# EAGLE design Front (EAGLE 9.2.2)
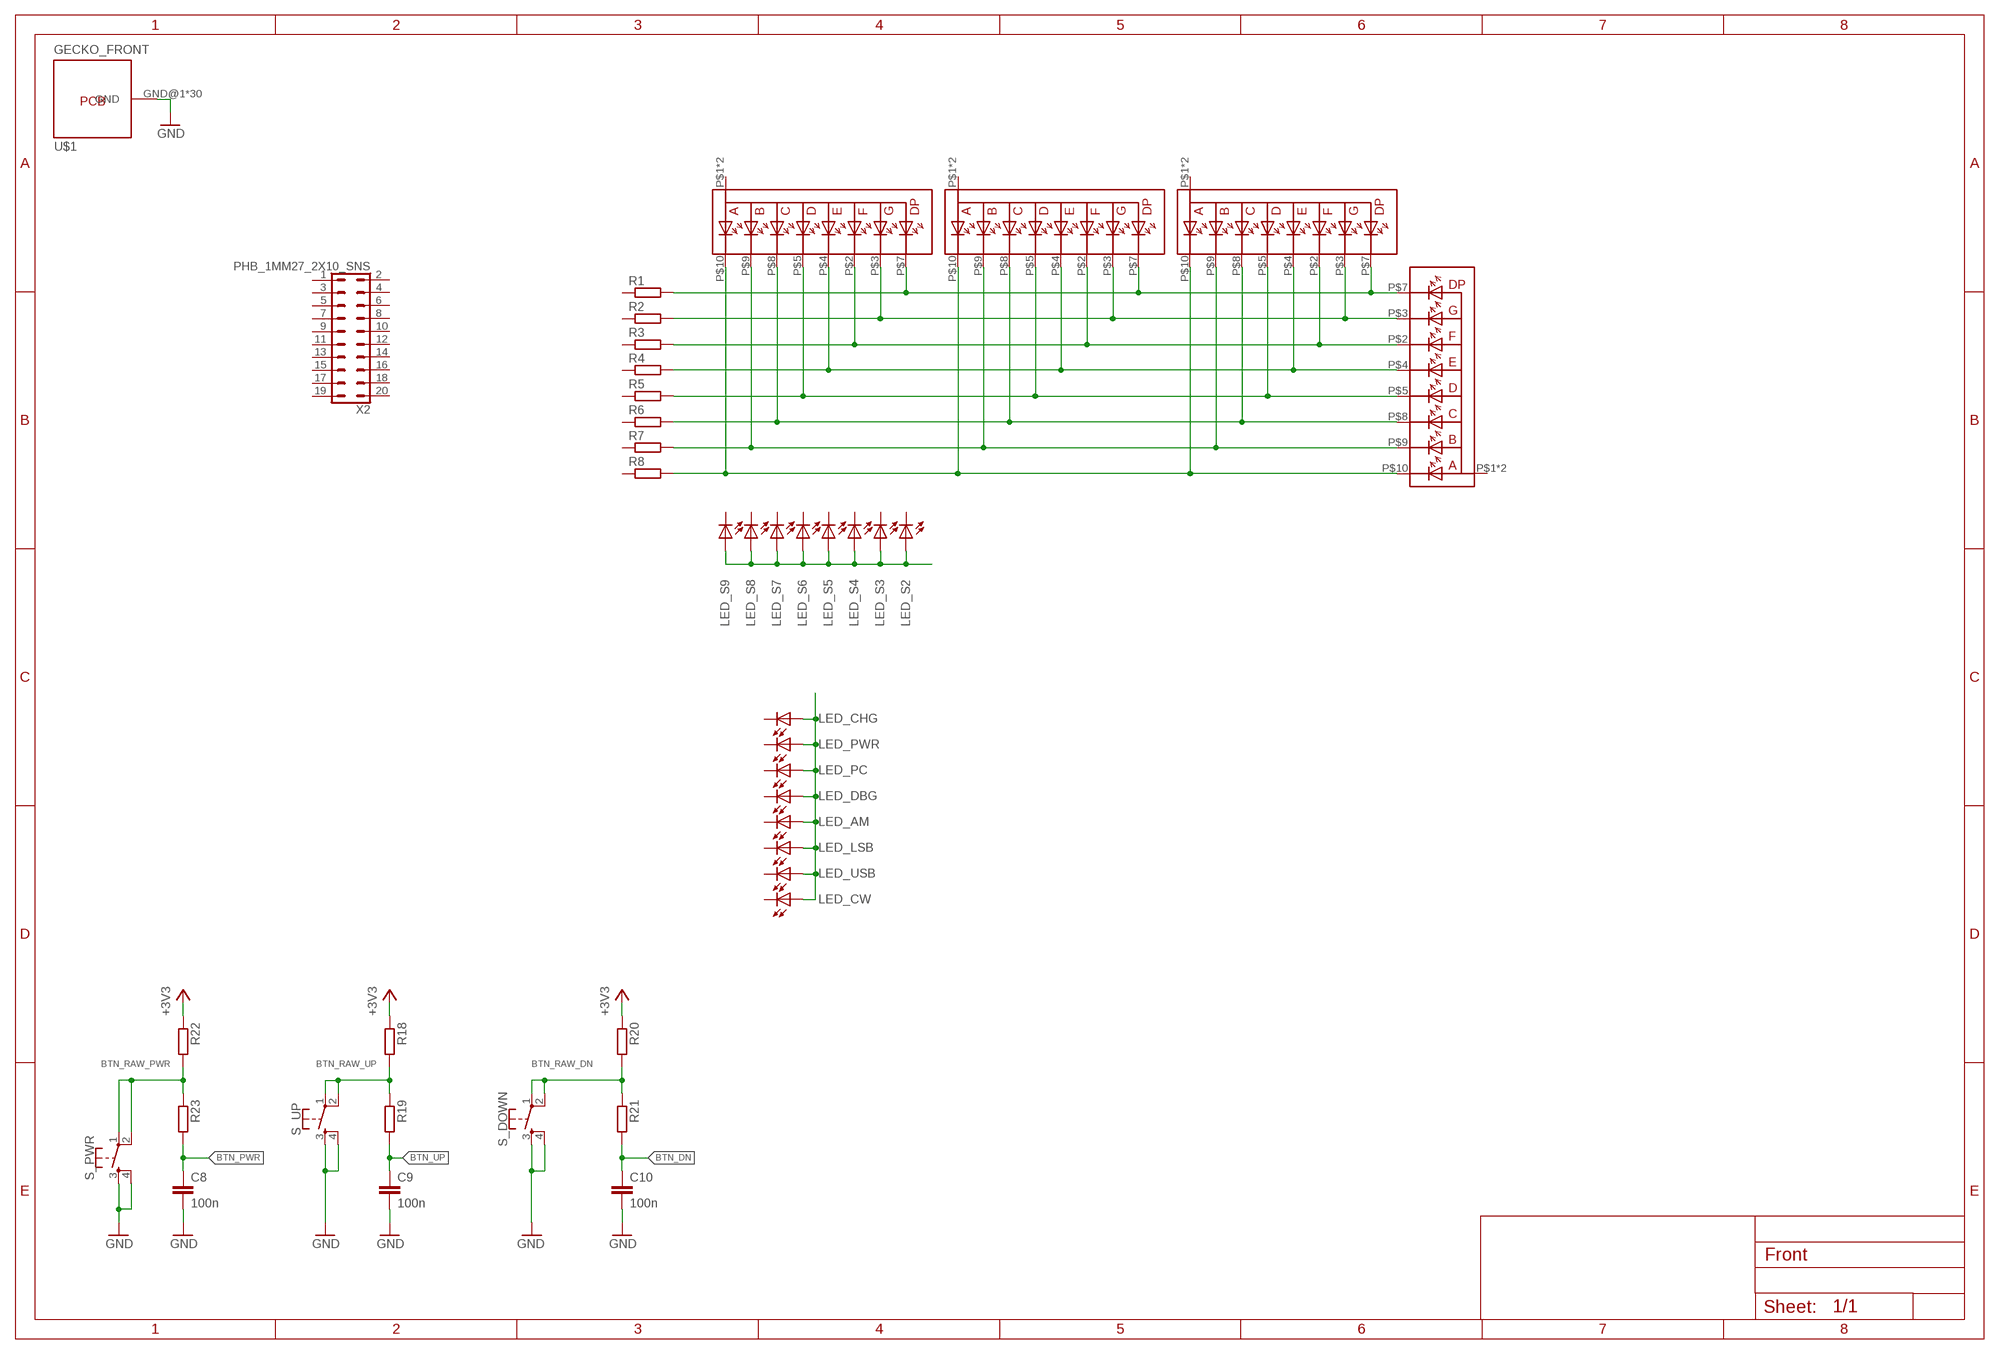
[diagram p0: schematic, sheet 1]

## Parts
C8  100n  C-EUC0402  [C0402]
C9  100n  C-EUC0402  [C0402]
C10  100n  C-EUC0402  [C0402]
D3  HDSP-C3E1  [7SEG_THT]
LED_AM  LEDCHIPLED_0603  [CHIPLED_0603]
LED_CHG  LEDCHIPLED_0603  [CHIPLED_0603]
LED_CW  LEDCHIPLED_0603  [CHIPLED_0603]
LED_DBG  LEDCHIPLED_0603  [CHIPLED_0603]
LED_LSB  LEDCHIPLED_0603  [CHIPLED_0603]
LED_PC  LEDCHIPLED_0603  [CHIPLED_0603]
LED_PWR  LEDCHIPLED_0603  [CHIPLED_0603]
LED_S2  LEDCHIPLED_0603  [CHIPLED_0603]
LED_S3  LEDCHIPLED_0603  [CHIPLED_0603]
LED_S4  LEDCHIPLED_0603  [CHIPLED_0603]
LED_S5  LEDCHIPLED_0603  [CHIPLED_0603]
LED_S6  LEDCHIPLED_0603  [CHIPLED_0603]
LED_S7  LEDCHIPLED_0603  [CHIPLED_0603]
LED_S8  LEDCHIPLED_0603  [CHIPLED_0603]
LED_S9  LEDCHIPLED_0603  [CHIPLED_0603]
LED_USB  LEDCHIPLED_0603  [CHIPLED_0603]
R1  R-EU_R0402  [R0402]
R2  R-EU_R0402  [R0402]
R3  R-EU_R0402  [R0402]
R4  R-EU_R0402  [R0402]
R5  R-EU_R0402  [R0402]
R6  R-EU_R0402  [R0402]
R7  R-EU_R0402  [R0402]
R8  R-EU_R0402  [R0402]
R18  R-EU_R0402  [R0402]
R19  R-EU_R0402  [R0402]
R20  R-EU_R0402  [R0402]
R21  R-EU_R0402  [R0402]
R22  R-EU_R0402  [R0402]
R23  R-EU_R0402  [R0402]
S_DOWN  MOMENTARY-SWITCH-SPST-2-SMD-4.6X2.8MM  [TACTILE_SWITCH_SMD_4.6X2.8MM]
S_PWR  MOMENTARY-SWITCH-SPST-2-SMD-4.6X2.8MM  [TACTILE_SWITCH_SMD_4.6X2.8MM]
S_UP  MOMENTARY-SWITCH-SPST-2-SMD-4.6X2.8MM  [TACTILE_SWITCH_SMD_4.6X2.8MM]
U$1  GECKO_FRONT  [GECKO_FRONT]
U$9  HDSP-C3E1  [7SEG_THT]
U$10  HDSP-C3E1  [7SEG_THT]
U$11  HDSP-C3E1  [7SEG_THT]
X2  PHB_1MM27_2X10_SNS  [PHB_1MM27_2X10_SNS]

## Nets
+3V3: R18.1 R20.1 R22.1
BTN_DN: C10.1 R21.2
BTN_PWR: C8.1 R23.2
BTN_RAW_DN: R20.2 R21.1 S_DOWN.1 S_DOWN.2
BTN_RAW_PWR: R22.2 R23.1 S_PWR.1 S_PWR.2
BTN_RAW_UP: R18.2 R19.1 S_UP.1 S_UP.2
BTN_UP: C9.1 R19.2
GND: C8.2 C9.2 C10.2 S_DOWN.3 S_DOWN.4 S_PWR.3 S_PWR.4 S_UP.3 S_UP.4 U$1.GND@1(GND) U$1.GND@2(GND) U$1.GND@3(GND) U$1.GND@4(GND) U$1.GND@5(GND) U$1.GND@6(GND) U$1.GND@7(GND) U$1.GND@8(GND) U$1.GND@9(GND) U$1.GND@10(GND) U$1.GND@11(GND) U$1.GND@12(GND) U$1.GND@13(GND) U$1.GND@14(GND) U$1.GND@15(GND) U$1.GND@16(GND) U$1.GND@17(GND) U$1.GND@18(GND) U$1.GND@19(GND) U$1.GND@20(GND) U$1.GND@21(GND) U$1.GND@22(GND) U$1.GND@23(GND) U$1.GND@24(GND) U$1.GND@25(GND) U$1.GND@26(GND) U$1.GND@27(GND) U$1.GND@28(GND) U$1.GND@29(GND) U$1.GND@30(GND)
N$1: D3.P$7(DP) R1.2 U$9.P$7(DP) U$10.P$7(DP) U$11.P$7(DP)
N$2: D3.P$3(G) R2.2 U$9.P$3(G) U$10.P$3(G) U$11.P$3(G)
N$3: D3.P$2(F) R3.2 U$9.P$2(F) U$10.P$2(F) U$11.P$2(F)
N$4: D3.P$4(E) R4.2 U$9.P$4(E) U$10.P$4(E) U$11.P$4(E)
N$5: D3.P$5(D) R5.2 U$9.P$5(D) U$10.P$5(D) U$11.P$5(D)
N$6: D3.P$8(C) R6.2 U$9.P$8(C) U$10.P$8(C) U$11.P$8(C)
N$7: D3.P$9(B) R7.2 U$9.P$9(B) U$10.P$9(B) U$11.P$9(B)
N$8: D3.P$10(A) R8.2 U$9.P$10(A) U$10.P$10(A) U$11.P$10(A)
N$77: LED_AM.A LED_CHG.A LED_CW.A LED_DBG.A LED_LSB.A LED_PC.A LED_PWR.A LED_USB.A
N$82: LED_S2.A LED_S3.A LED_S4.A LED_S5.A LED_S6.A LED_S7.A LED_S8.A LED_S9.A
Unconnected: D3.P$1(CA) D3.P$6(CA) LED_AM.C LED_CHG.C LED_CW.C LED_DBG.C LED_LSB.C LED_PC.C LED_PWR.C LED_S2.C LED_S3.C LED_S4.C LED_S5.C LED_S6.C LED_S7.C LED_S8.C LED_S9.C LED_USB.C R1.1 R2.1 R3.1 R4.1 R5.1 R6.1 R7.1 R8.1 U$9.P$1(CA) U$9.P$6(CA) U$10.P$1(CA) U$10.P$6(CA) U$11.P$1(CA) U$11.P$6(CA) X2.1 X2.2 X2.3 X2.4 X2.5 X2.6 X2.7 X2.8 X2.9 X2.10 X2.11 X2.12 X2.13 X2.14 X2.15 X2.16 X2.17 X2.18 X2.19 X2.20

## Library data of the parts
C8-C10 = rcl:C-EU: CAPACITOR, European symbol; OC_FARNELL: unknown; SPICEPREFIX: C
D3 U$9-U$11 = MyLib:HDSP-C3E1
LED_AM LED_CHG LED_CW LED_DBG LED_LSB LED_PC LED_PWR LED_S2-LED_S9 LED_USB = led:LED: LED OSRAM: - CHIPLED LG R971, LG N971, LY N971, LG Q971, LY Q971, LO R971, LY R971 LH N974, LH R974 LS Q976, LO Q976, LY Q976 LO Q996 - Hyper CHIPLED LW Q18S LB Q993, LB Q99A, LB R99A - SideLED LS A670, LO A670, LY A670, LG A670, LP A670 LB A673, LV A673, LT A673, LW A673 LH A674 LY A675 LS A676, LA A676, LO A676, LY A676, LW A676 LS A679, LY A679, LG A679 - Hyper Micro SIDELED® LS Y876, LA Y876, LO Y876, LY Y876 LT Y87S - SmartLED LW L88C, LW L88S LB L89C, LB L89S, LG L890 LS L89K, LO L89K, LY L89K LS L896, LA L896, LO L896, LY L896 - TOPLED LS T670, LO T670, LY T670, LG T670, LP T670 LSG T670, LSP T670, LSY T670, LOP T670, LYG T670 LG T671, LOG T671, LSG T671 LB T673, LV T673, LT T673, LW T673 LH T674 LS T676, LA T676, LO T676, LY T676, LB T676, LH T676, LSB T676, LW T676 LB T67C, LV T67C, LT T67C, LS T67K, LO T67K, LY T67K, LW E67C LS E67B, LA E67B, LO E67B, LY E67B, LB E67C, LV E67C, LT E67C LW T67C LS T679, LY T679, LG T679 LS T770, LO T770, LY T770, LG T770, LP T770 LB T773, LV T773, LT T773, LW T773 LH T774 LS E675, LA E675, LY E675, LS T675 LS T776, LA T776, LO T776, LY T776, LB T776 LHGB T686 LT T68C, LB T68C - Hyper Mini TOPLED® LB M676 - Mini TOPLED Santana® LG M470 LS M47K, LO M47K, LY M47K Source: http://www.osram.convergy.de LUXEON: - LUMILED® LXK2-PW12-R00, LXK2-PW12-S00, LXK2-PW14-U00, LXK2-PW14-V00 LXK2-PM12-R00, LXK2-PM12-S00, LXK2-PM14-U00 LXK2-PE12-Q00, LXK2-PE12-R00, LXK2-PE12-S00, LXK2-PE14-T00, LXK2-PE14-U00 LXK2-PB12-K00, LXK2-PB12-L00, LXK2-PB12-M00, LXK2-PB14-N00, LXK2-PB14-P00, LXK2-PB14-Q00 LXK2-PR12-L00, LXK2-PR12-M00, LXK2-PR14-Q00, LXK2-PR14-R00 LXK2-PD12-Q00, LXK2-PD12-R00, LXK2-PD12-S00 LXK2-PH12-R00, LXK2-PH12-S00 LXK2-PL12-P00, LXK2-PL12-Q00, LXK2-PL12-R00 Source: www.luxeon.com KINGBRIGHT: KA-3528ASYC Source: www.kingbright.com; MF: ROHM; MPN: SML-E12UWT86; OC_FARNELL: 2762561
R1-R8 R18-R23 = rcl:R-EU_: RESISTOR, European symbol; SPICEPREFIX: R
S_DOWN S_PWR S_UP = SparkFun-Switches:MOMENTARY-SWITCH-SPST-2: Momentary Switch (Pushbutton) - SPST - Two Circuits Normally-open (NO) SPST momentary switches (buttons, pushbuttons). Schematic symbol includes two switch circuits. Variants SMD-4.6MMX2.8MM - 4.60mm x 2.80mm Tactile Momentary Button Switch - Used on SparkFun SAMD21 Mini Breakout <https://www.sparkfun.com/products/13664> SMD-5.2MM - Mini Pushbutton Switch - SMD <https://www.sparkfun.com/products/8720> - Used on Arduino Pro Mini <https://www.sparkfun.com/products/11114>; OC_FARNELL: unknown; PROD_ID: SWCH-13065
U$1 = MyLib:GECKO_FRONT; OC_FARNELL: unknown
X2 = _hhn_con_pinhead_box_1mm27:PHB_1MM27_2X10_*: Pin Header Box-Type, 1.27mm/0.5"/50mil Pitch, 2x10 Circuits Note: see library description for an important note about THT-version

## Board
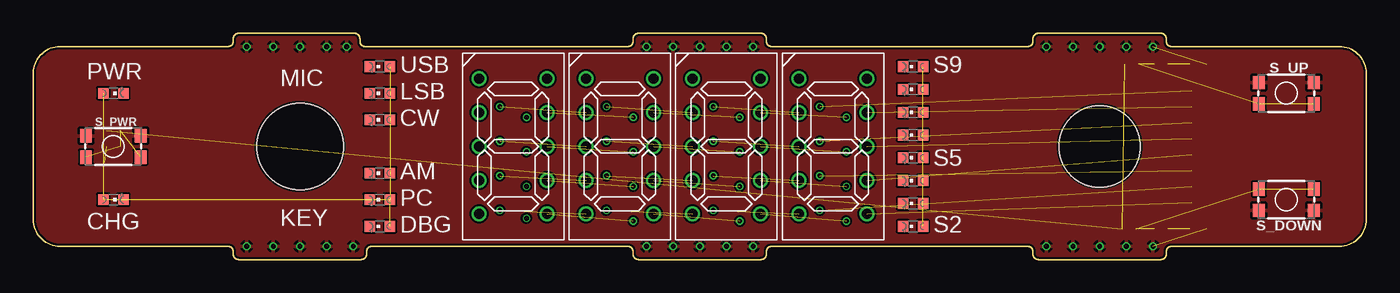
[diagram p1: board, top side]
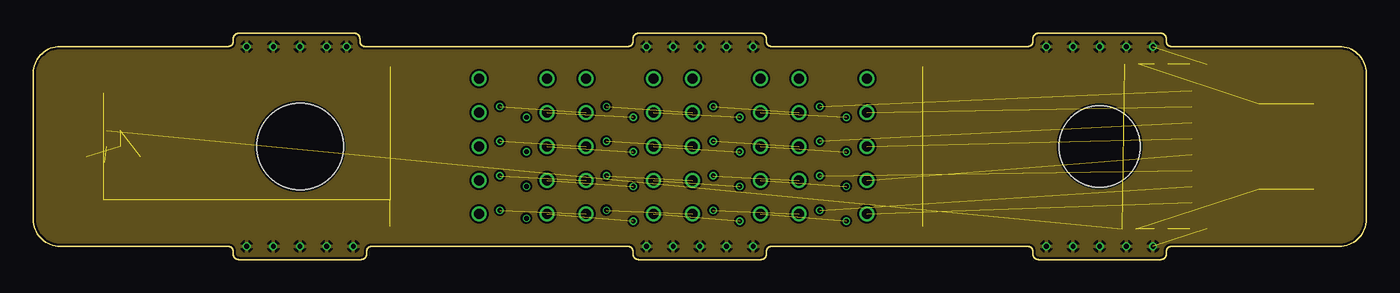
[diagram p2: board, inner layer Route2]
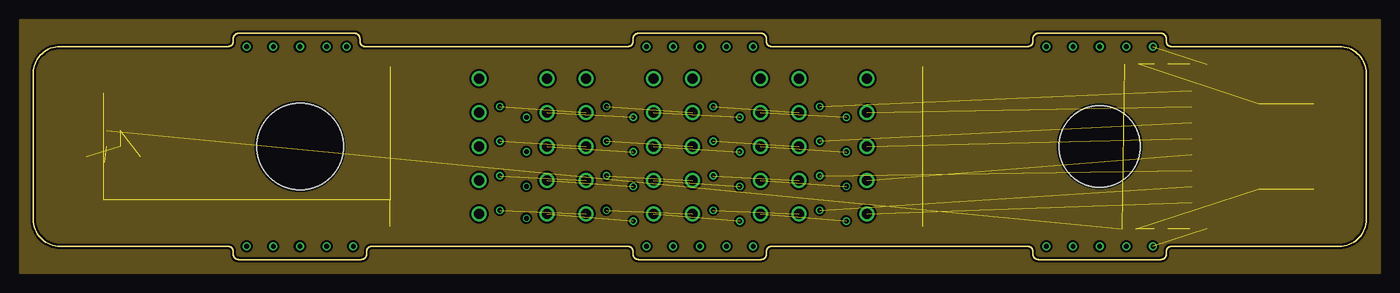
[diagram p3: board, inner layer Route15]
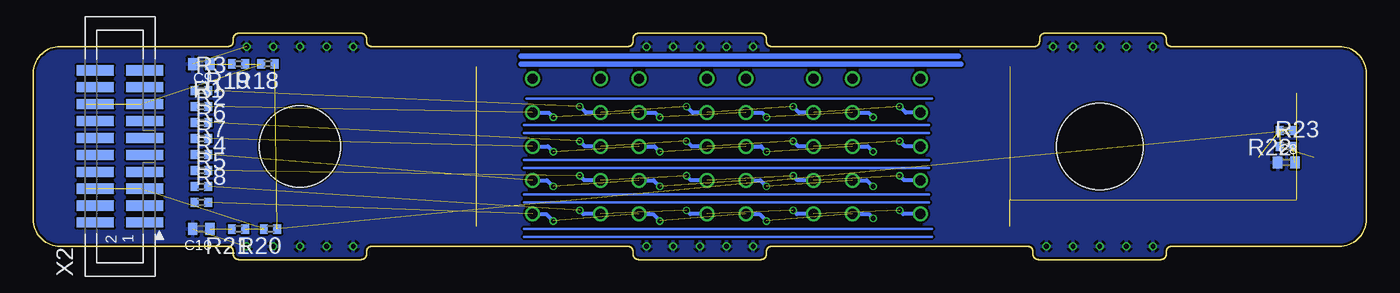
[diagram p4: board, bottom side, seen from below]

Size 100 x 17 mm. Coordinates in mm from the lower left corner, seen from the top.
Copper layers (1*16): Top 0.035mm / dielectric 0.36mm / Bottom 0.035mm
Design rules "Multi-CB_4L_100цm-Tracks_OL35цm-IL35цm *": minimum track width 0.2mm, minimum drill 0.3mm, track to track 6mil, track to pad 6mil, pad to pad 6mil, via to via 6mil, smd to smd 0mil, copper to edge 6mil, drill to drill 6mil, minimum pad ring 0.125mm, minimum via ring 0.1mm, stop-mask expansion 2mil, vias tented up to drill 0.45mm, thermal gap 0.2mm

### Footprints (pad centres in the part's own frame; a part is rotated, then mirrored left to right if it is on the bottom)
C0402 = smd 0.7 x 0.9: 1 -0.65,0; 2 0.65,0
7SEG_THT = drill 0.75: P$1 -2.54,5.08; P$2 -2.54,2.54; P$3 -2.54,0; P$4 -2.54,-2.54; P$5 -2.54,-5.08; P$6 2.54,5.08; P$7 2.54,2.54; P$8 2.54,0; P$9 2.54,-2.54; P$10 2.54,-5.08
CHIPLED_0603 = smd 0.8 x 0.8: A 0,-0.75; C 0,0.75
R0402 = smd 0.6 x 0.7: 1 -0.5,0; 2 0.5,0
TACTILE_SWITCH_SMD_4.6X2.8MM = smd 0.9 x 1: 1 -2.05,-0.8; 2 2.05,-0.8; 3 2.05,0.8; 4 -2.05,0.8
GECKO_FRONT = drill 0.35: GND@1 -34,7.5; GND@2 -32,7.5; GND@3 -30,7.5; GND@4 -28,7.5; GND@5 -26.5,7.5; GND@6 -4,7.5; GND@7 -2,7.5; GND@8 0,7.5; GND@9 2,7.5; GND@10 4,7.5; GND@11 26,7.5; GND@12 28,7.5; GND@13 30,7.5; GND@14 32,7.5; GND@15 34,7.5; GND@16 -34,-7.5; GND@17 -32,-7.5; GND@18 -30,-7.5; GND@19 -28,-7.5; GND@20 -26,-7.5; GND@21 -4,-7.5; GND@22 -2,-7.5; GND@23 0,-7.5; GND@24 2,-7.5; GND@25 4,-7.5; GND@26 26,-7.5; GND@27 28,-7.5; GND@28 30,-7.5; GND@29 32,-7.5; GND@30 34,-7.5 | hole 6.5: -30,0 | hole 6.1: 30,0
PHB_1MM27_2X10_SNS = smd 0.76 x 2.8: 1 -5.715,-1.85; 2 -5.715,1.85; 3 -4.445,-1.85; 4 -4.445,1.85; 5 -3.175,-1.85; 6 -3.175,1.85; 7 -1.905,-1.85; 8 -1.905,1.85; 9 -0.635,-1.85; 10 -0.635,1.85; 11 0.635,-1.85; 12 0.635,1.85; 13 1.905,-1.85; 14 1.905,1.85; 15 3.175,-1.85; 16 3.175,1.85; 17 4.445,-1.85; 18 4.445,1.85; 19 5.715,-1.85; 20 5.715,1.85

### Placement (x,y rotation side)
C8  6,7.3 180 bottom
C9  87.4,14.7 180 bottom
C10  87.4,2.3 180 bottom
D3  52,8.5 0 top
LED_AM  26,6.5 90 top
LED_CHG  6,4.5 270 top
LED_CW  26,14.5 90 top
LED_DBG  26,4.5 90 top
LED_LSB  26,10.5 90 top
LED_PC  26,2.5 90 top
LED_PWR  6,12.5 270 top
LED_S2  66,2.5 90 top
LED_S3  66,4.21 90 top
LED_S4  66,5.93 90 top
LED_S5  66,7.64 90 top
LED_S6  66,9.36 90 top
LED_S7  66,11.07 90 top
LED_S8  66,12.79 90 top
LED_S9  66,14.5 90 top
LED_USB  26,12.5 90 top
R1  87.4,11.5 0 bottom
R2  87.4,10.3 0 bottom
R3  87.4,12.7 0 bottom
R4  87.4,6.7 0 bottom
R5  87.4,5.5 0 bottom
R6  87.4,9.1 0 bottom
R7  87.4,7.9 0 bottom
R8  87.4,4.3 0 bottom
R18  82.4,14.7 180 bottom
R19  84.6,14.7 180 bottom
R20  82.2,2.3 180 bottom
R21  84.6,2.3 180 bottom
R22  6,9.7 180 bottom
R23  6,8.5 0 bottom
S_DOWN  94,4.5 180 top
S_PWR  6,8.5 0 top
S_UP  94,12.5 0 top
U$1  50,8.5 0 top
U$9  60,8.5 0 top
U$10  44,8.5 0 top
U$11  36,8.5 0 top
X2  93.5,8.5 90 bottom

### Tracks (layer width: path | path; a pad name or v marks a point on that pad's centre or on a via)
+3V3  (2 unrouted)
  pour Route15: -1,-1 -1,18 101,18 101,-1
BTN_DN  (1 unrouted)
BTN_PWR  (1 unrouted)
BTN_RAW_DN  (3 unrouted)
BTN_RAW_PWR  (3 unrouted)
BTN_RAW_UP  (3 unrouted)
BTN_UP  (1 unrouted)
GND  (2 unrouted)
  pour Top: -1,-1 -1,18 101,18 101,-1
  pour Bottom: -1,-1 -1,18 101,18 101,-1
  pour Route2: -1,-1 -1,18 101,18 101,-1
N$1  (via drill 0.35)  (4 unrouted)
  Bottom 0.3: U$11.P$7 37.34,11.04 v37,10.7 | U$10.P$7 45.34,11.04 v45,10.7 | D3.P$7 53.34,11.04 v53,10.7 | U$9.P$7 61.34,11.04 v61,10.7
N$2  (via drill 0.35)  (4 unrouted)
  Bottom 0.3: U$11.P$3 34.6,8.5 v35,8.9 | U$10.P$3 42.6,8.5 v43,8.9 | D3.P$3 50.6,8.5 v51,8.9 | U$9.P$3 58.6,8.5 v59,8.9
N$3  (via drill 0.35)  (4 unrouted)
  Bottom 0.3: U$11.P$2 34.54,11.04 v35,11.5 | U$10.P$2 42.54,11.04 v43,11.5 | D3.P$2 50.54,11.04 v51,11.5 | U$9.P$2 58.54,11.04 v59,11.5
N$4  (via drill 0.35)  (4 unrouted)
  Bottom 0.3: U$11.P$4 34.66,5.96 v35,6.3 | U$10.P$4 42.66,5.96 v43,6.3 | D3.P$4 50.66,5.96 v51,6.3 | U$9.P$4 58.66,5.96 v59,6.3
N$5  (via drill 0.35)  (4 unrouted)
  Bottom 0.3: U$11.P$5 34.72,3.42 v35,3.7 | U$10.P$5 42.72,3.42 v43,3.7 | D3.P$5 50.72,3.42 v51,3.7 | U$9.P$5 58.72,3.42 v59,3.7
N$6  (via drill 0.35)  (4 unrouted)
  Bottom 0.3: U$11.P$8 37.4,8.5 v37,8.1 | U$10.P$8 45.4,8.5 v45,8.1 | D3.P$8 53.4,8.5 v53,8.1 | U$9.P$8 61.4,8.5 v61,8.1
N$7  (via drill 0.35)  (4 unrouted)
  Bottom 0.3: U$11.P$9 37.46,5.96 v37,5.5 | U$10.P$9 45.46,5.96 v45,5.5 | D3.P$9 53.46,5.96 v53,5.5 | U$9.P$9 61.46,5.96 v61,5.5
N$8  (via drill 0.35)  (4 unrouted)
  Bottom 0.3: U$11.P$10 37.32,3.42 v37,3.1 | U$10.P$10 45.52,3.42 v45,2.9 | D3.P$10 53.52,3.42 v53,2.9 | U$9.P$10 61.52,3.42 v61,2.9
N$9
  Bottom 0.2: 32.6,1.7 63.2,1.7
N$10
  Bottom 0.2: 32.6,2.3 63.2,2.3
N$11
  Bottom 0.2: 32.8,4.3 63.2,4.3
N$12
  Bottom 0.2: 63.2,4.9 32.8,4.9 | 63.2,6.9 32.8,6.9 | 63.2,7.5 32.8,7.5 | 63.2,9.5 32.8,9.5 | 63.2,10.1 32.8,10.1 | 63,12.1 32.6,12.1
N$13
  Bottom 0.4: 63.4,14.7 30.4,14.7
N$14
  Bottom 0.4: 63.4,15.3 30.6,15.3
N$77  (7 unrouted)
N$82  (7 unrouted)

### Text on the board
tPlace: USB | S9 | PWR | MIC | LSB | CW | AM | S5 | PC | CHG | KEY | DBG | S2